# Altium schematic sheet Sheet1.SchDoc
size A
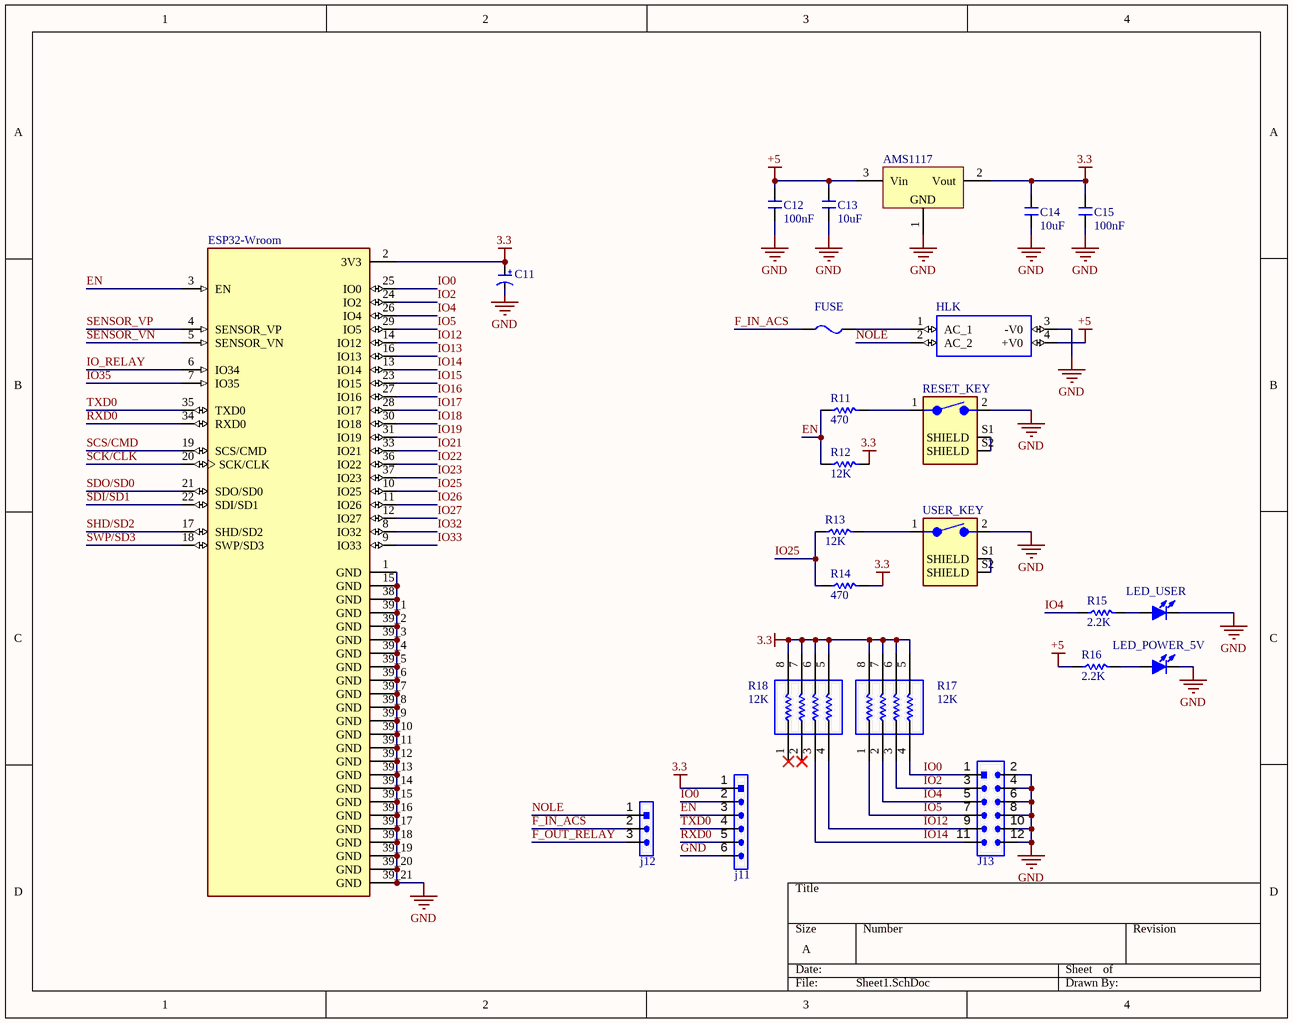
[diagram p0: Sheet1.SchDoc]

## Parts
AMS1117  AMS1117-3V3  [SOT223_L]  (value not drawn)
C11  (no value)  [CD A(3216)]
C12  100nF  [C 0805]
C13  10uF  [C 0805]
C14  10uF  [C 0805]
C15  100nF  [C 0805]
ESP32-Wroom  ESP32-WROOM-32  [MODULE_ESP32-WROOM-32]  (value not drawn)
FUSE  MSMD200-8V 2A  [FU 0805]  (value not drawn)
HLK  HLK-PM01  [HLKPM01]  (value not drawn)
j11  HDR-1X6  [HDR-1X6]  (value not drawn)
j12  HDR-1X3  [HDR-1X3]  (value not drawn)
J13  Header 6X2  [HDR-6X2]  (value not drawn)
LED_POWER_5V  LED-SMD  [LED 0805R]  (value not drawn)
LED_USER  LED-SMD  [LED 0805G]  (value not drawn)
R11  470  [R 0805]
R12  12K  [R 0805]
R13  12K  [R 0805]
R14  470  [R 0805]
R15  2.2K  [R 0805]
R16  2.2K  [R 0805]
R17  12K  [RA0805 (4D02)-L]
R18  12K  [RA0805 (4D02)-L]
RESET_KEY  1-1825027-1  [SW_1-1825027-1]  (value not drawn)
USER_KEY  1-1825027-1  [SW_1-1825027-1]  (value not drawn)

## Nets
3.3: AMS1117.2(Vout) C11.1(A) C14.2 C15.2 ESP32-Wroom.2(3V3) j11.1 R12.2 R14.2 R17.5 R17.6 R17.7 R17.8 R18.5 R18.6 R18.7 R18.8
+5: AMS1117.3(Vin) C12.2 C13.2 HLK.4(+V0) R16.1
GND: AMS1117.1(GND) C11.2(K) C12.1 C13.1 C14.1 C15.1 ESP32-Wroom.1(GND) ESP32-Wroom.15(GND) ESP32-Wroom.38(GND) ESP32-Wroom.39_1(GND) ESP32-Wroom.39_2(GND) ESP32-Wroom.39_3(GND) ESP32-Wroom.39_4(GND) ESP32-Wroom.39_5(GND) ESP32-Wroom.39_6(GND) ESP32-Wroom.39_7(GND) ESP32-Wroom.39_8(GND) ESP32-Wroom.39_9(GND) ESP32-Wroom.39_10(GND) ESP32-Wroom.39_11(GND) ESP32-Wroom.39_12(GND) ESP32-Wroom.39_13(GND) ESP32-Wroom.39_14(GND) ESP32-Wroom.39_15(GND) ESP32-Wroom.39_16(GND) ESP32-Wroom.39_17(GND) ESP32-Wroom.39_18(GND) ESP32-Wroom.39_19(GND) ESP32-Wroom.39_20(GND) ESP32-Wroom.39_21(GND) HLK.3(-V0) j11.6 J13.2 J13.4 J13.6 J13.8 J13.10 J13.12 LED_POWER_5V.2(K) LED_USER.2(K) RESET_KEY.2 USER_KEY.2
EN: ESP32-Wroom.3(EN) j11.3 R11.1 R12.1
F_IN_ACS: FUSE.1 j12.2
F_OUT_RELAY: j12.3
IO0: ESP32-Wroom.25(IO0) j11.2 J13.1 R17.4
IO2: ESP32-Wroom.24(IO2) J13.3 R17.3
IO4: ESP32-Wroom.26(IO4) J13.5 R15.1 R17.2
IO5: ESP32-Wroom.29(IO5) J13.7 R17.1
IO12: ESP32-Wroom.14(IO12) J13.9 R18.4
IO13: ESP32-Wroom.16(IO13)
IO14: ESP32-Wroom.13(IO14) J13.11 R18.3
IO15: ESP32-Wroom.23(IO15)
IO16: ESP32-Wroom.27(IO16)
IO17: ESP32-Wroom.28(IO17)
IO18: ESP32-Wroom.30(IO18)
IO19: ESP32-Wroom.31(IO19)
IO21: ESP32-Wroom.33(IO21)
IO22: ESP32-Wroom.36(IO22)
IO23: ESP32-Wroom.37(IO23)
IO25: ESP32-Wroom.10(IO25) R13.1 R14.1
IO26: ESP32-Wroom.11(IO26)
IO27: ESP32-Wroom.12(IO27)
IO32: ESP32-Wroom.8(IO32)
IO33: ESP32-Wroom.9(IO33)
IO35: ESP32-Wroom.7(IO35)
IO_RELAY: ESP32-Wroom.6(IO34)
NOLE: HLK.2(AC_2) j12.1
RXD0: ESP32-Wroom.34(RXD0) j11.5
SCK/CLK: ESP32-Wroom.20(SCK/CLK)
SCS/CMD: ESP32-Wroom.19(SCS/CMD)
SDI/SD1: ESP32-Wroom.22(SDI/SD1)
SDO/SD0: ESP32-Wroom.21(SDO/SD0)
SENSOR_VN: ESP32-Wroom.5(SENSOR_VN)
SENSOR_VP: ESP32-Wroom.4(SENSOR_VP)
SHD/SD2: ESP32-Wroom.17(SHD/SD2)
SWP/SD3: ESP32-Wroom.18(SWP/SD3)
TXD0: ESP32-Wroom.35(TXD0) j11.4
NetFUSE_2: FUSE.2 HLK.1(AC_1)
NetLED_POWER_5V_1: LED_POWER_5V.1(A) R16.2
NetLED_USER_1: LED_USER.1(A) R15.2
NetR11_2: R11.2 RESET_KEY.1
NetR13_2: R13.2 USER_KEY.1
NetRESET_KEY_S1: RESET_KEY.S1(SHIELD) RESET_KEY.S2(SHIELD)
NetUSER_KEY_S1: USER_KEY.S1(SHIELD) USER_KEY.S2(SHIELD)

Not connected (* = marked no-connect by the designer): R18 1* 2*

## Notes on the sheet
- (in symbol C-CD) +

## Library data of the parts
AMS1117 = AMS1117: Three-terminal regulator chip; BOM名称: 稳压芯片; 版权归属: 源创客; 学习资源: www.ooocke.com
C11 = C-CD: Solid Tantalum Chip Capacitor, Standard T491 Series - Industrial Grade; Published: 17-Jul-2002; LatestRevisionDate: 19-Mar-2004; LatestRevisionNote: Silkscreen dimensions re-sized.; DatasheetDocument: Mar-2001; PackageDocument: Mar-2001; PackageReference: B; Publisher: Altium Limited; Code_JEITA: 3528-21; ComponentLink1Description: Manufacturer Link; ComponentLink1URL: http://www.kemet.com/; ComponentLink2Description: Datasheet; ComponentLink2URL: http://www.kemet.com/kemet/web/homepage/kechome.nsf/vapubfilesname/F3102TA.pdf/$file/F3102TA.pdf
C12-C15 = C: Non-polar patch capacitor; BOM名称: 无极性贴片电容; 版权归属: 源创客; 学习资源: www.ooocke.com
ESP32-Wroom = ESP32-WROOM-32: Bluetooth, WiFi Transceiver Module 2.4GHz ~ 2.5GHz Surface Mount; MF: Espressif Systems; Package: Module Espressif Systems; Digi-Key_Part_Number: 1904-1010-1-ND; Digi-Key_Purchase_URL: https://www.digikey.com/product-detail/en/espressif-systems/ESP32-WROOM-32/1904-1010-1-ND/8544305?utm_source=snapeda&utm_medium=aggregator&utm_campaign=symbol; Value: *; MP: ESP32-WROOM-32; SnapEDA_Link: https://www.snapeda.com/parts/ESP32-WROOM-32/Espressif%20Systems/view-part/2753322/?ref=snap
FUSE = FU: Chip fuse; BOM名称: 贴片保险丝; 版权归属: 源创客; 学习资源: www.ooocke.com
HLK = HLK-PM01: <b>Ultra-compact power module</b><p> Source: <a href="https://datasheet.lcsc.com/szlcsc/1906201102_HI-LINK-HLK-PM03_C209904.pdf"> Datasheet </a>; Package: Package Analog Devices; MF: Hi-link; Availability: Unavailable; Value: *; MP: hlk-pm01; Price: None; SnapEDA_Link: https://www.snapeda.com/parts/hlk-pm01/Hi-link/view-part/2875605/?ref=snap
j11 = Header 6: 6P Connector; BOM名称: 6P接插件; 版权归属: 源创客; 学习资源: www.ooocke.com
j12 = Header 3: 3P Connector; BOM名称: 3P接插件; 版权归属: 源创客; 学习资源: www.ooocke.com
J13 = Header  6X2: 6*2P Connector; BOM名称: 6*2P接插件; 版权归属: 源创客; 学习资源: www.ooocke.com
LED_POWER_5V LED_USER = LED-SMD: Patch LED; BOM名称: 贴片LED; 版权归属: 源创客; 学习资源: www.ooocke.com
R11-R16 = R: Chip resistor; 版权归属: 源创客; BOM名称: Chip resistor; 学习资源: www.ooocke.com
R17 R18 = R-ARR: 4 way Chip Resistor Array
RESET_KEY USER_KEY = 1-1825027-1: Switch Push Button OFF _ON_ SPST Round Button 0.05A 24VDC Momentary Contact PC Pins Thru-Hole; MF: TE Connectivity; Package: None; EU_RoHS_Compliance: Compliant; Price: None; TE_purchase_URL: https://www.te.com/usa-en/product-1-1825027-1.html?te_bu=Cor&te_type=disp&te_campaign=seda_glo_cor-seda-global-disp-prtnr-fy19-seda-model-bom-cta_sma-317_1&elqCampaignId=32493; SnapEDA_Link: https://www.snapeda.com/parts/1-1825027-1/TE%20Connectivity%20ALCOSWITCH%20Switches/view-part/394875/?ref=snap; Availability: Unavailable; Value: *; MP: 1-1825027-1